# Altium schematic sheet PowerBoard.SchDoc
size A3; SheetNumber: 1; SheetTotal: 1
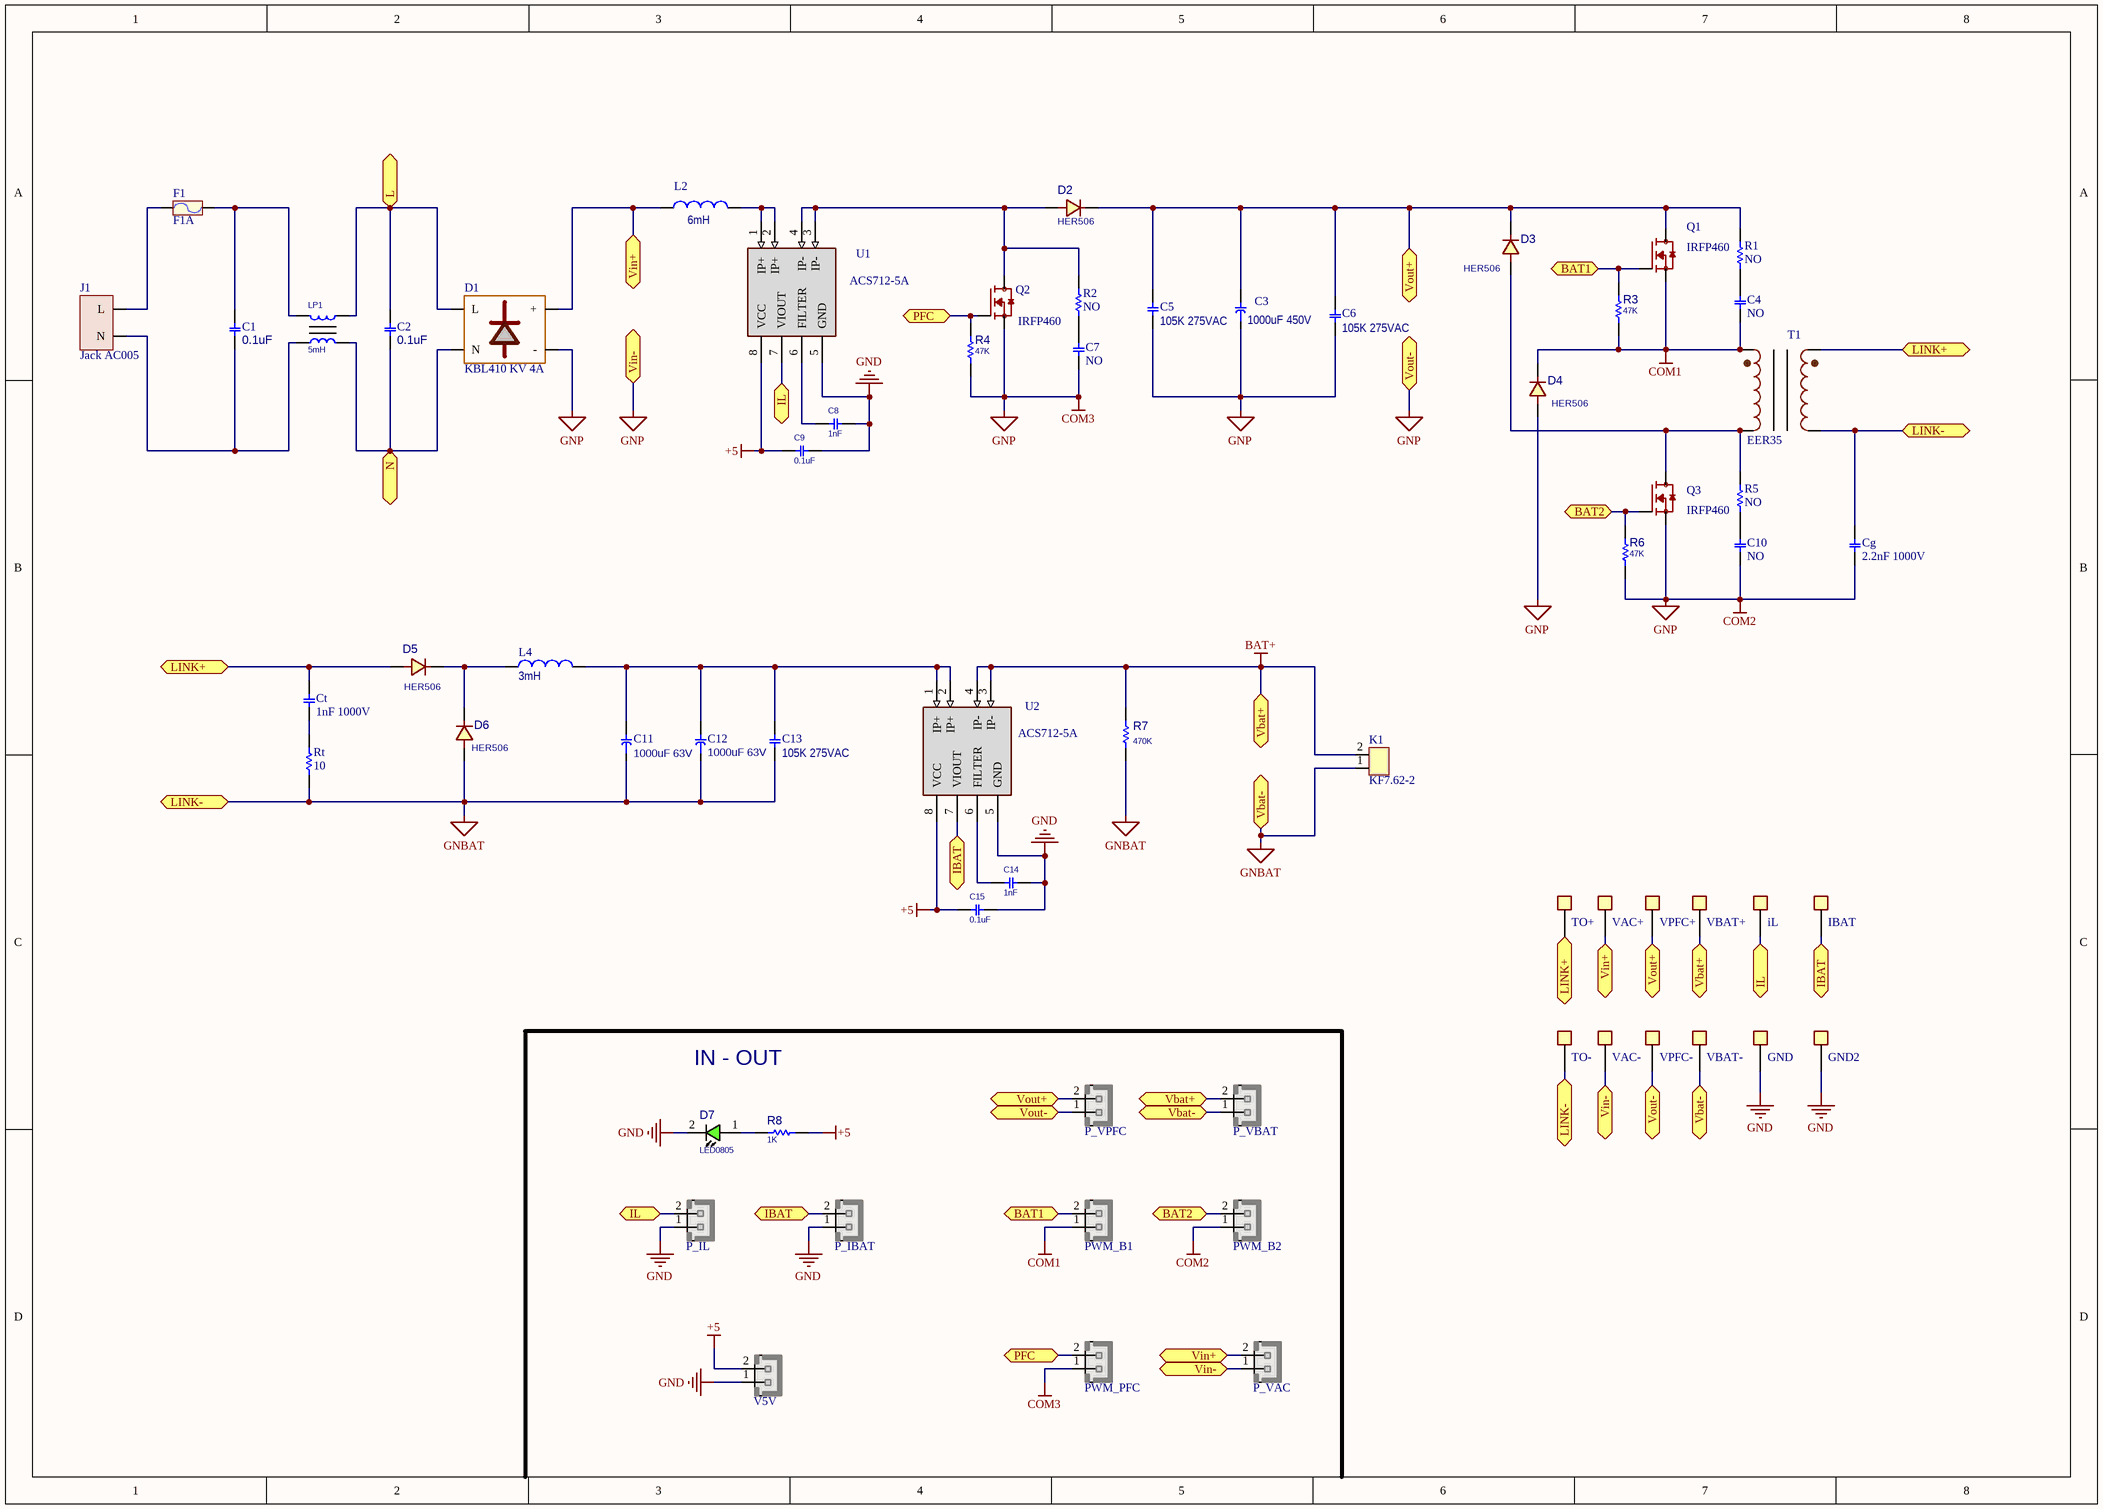
[diagram p0: PowerBoard.SchDoc]

## Parts
C1  0.1uF  [CAP P=15MM]
C2  0.1uF  [CAP P=15MM]
C3  1000uF 450V  [cap dxl 35x45]
C4  NO  [CAP CBB22 100nF/630V]
C5  105K 275VAC  [CAP P=22.5mm Len=26.5]
C6  105K 275VAC  [CAP P=22.5mm Len=26.5]
C7  NO  [CAP CBB22 100nF/630V]
C8  1nF  [cap_0805]
C9  0.1uF  [cap_0805]
C10  NO  [CAP CBB22 100nF/630V]
C11  1000uF 63V  [CAP DxL 16x25]
C12  1000uF 63V  [CAP DxL 16x25]
C13  105K 275VAC  [CAP P=22.5mm Len=26.5]
C14  1nF  [cap_0805]
C15  0.1uF  [cap_0805]
Cg  2.2nF 1000V  [CAP CERAMIC Blue]
Ct  1nF 1000V  [CAP CERAMIC Blue]
D1  KBL410 KV 4A  [SIP-4 KBL]
D2  value HER506  [DIODE DO-201AD]  (hidden comment: DIODE DIP)
D3  value HER506  [DIODE DO-201AD]  (hidden comment: DIODE DIP)
D4  value HER506  [DIODE DO-201AD]  (hidden comment: DIODE DIP)
D5  value HER506  [DIODE DO-201AD]  (hidden comment: DIODE DIP)
D6  value HER506  [DIODE DO-201AD]  (hidden comment: DIODE DIP)
D7  LED0805  [LED0805]
F1  F1A  [FUSE]
GND  test PCB  [Tp_black_1p]  (value not drawn)
GND2  test PCB  [Tp_black_1p]  (value not drawn)
IBAT  test PCB  [tp_red_1p]  (value not drawn)
iL  test PCB  [tp_red_1p]  (value not drawn)
J1  Jack AC005  [AC005]
K1  KF7.62-2  [KF_2PIN]
L2  6mH  [IND 40P]
L4  3mH  [IND 40P]
LP1  5mH  [Filter Inductor]
P_IBAT  HHDR_2  [XH_2]  (value not drawn)
P_IL  HHDR_2  [XH_2]  (value not drawn)
P_VAC  HHDR_2  [VH-2]  (value not drawn)
P_VBAT  HHDR_2  [VH-2]  (value not drawn)
P_VPFC  HHDR_2  [VH-2]  (value not drawn)
PWM_B1  HHDR_2  [VH-2]  (value not drawn)
PWM_B2  HHDR_2  [VH-2]  (value not drawn)
PWM_PFC  HHDR_2  [VH-2]  (value not drawn)
Q1  IRFP460  [TO-247 - HS342512]
Q2  IRFP460  [TO-247 - HS342512]
Q3  IRFP460  [TO-247 - HS342512]
R1  NO  [R-2W]
R2  NO  [R-2W]
R3  47K  [R0805]
R4  47K  [R0805]
R5  NO  [R-2W]
R6  47K  [R0805]
R7  470K  [R1206]
R8  1K  [R0805]
Rt  10  [R1/4W4]
T1  EER35  [Pulse Transformer]
TO+  test PCB  [tp_red_1p]  (value not drawn)
TO-  test PCB  [Tp_black_1p]  (value not drawn)
U1  ACS712-5A  [ACS712]
U2  ACS712-5A  [ACS712]
V5V  HHDR_2  [VH-2]  (value not drawn)
VAC+  test PCB  [tp_red_1p]  (value not drawn)
VAC-  test PCB  [Tp_black_1p]  (value not drawn)
VBAT+  test PCB  [tp_red_1p]  (value not drawn)
VBAT-  test PCB  [Tp_black_1p]  (value not drawn)
VPFC+  test PCB  [tp_red_1p]  (value not drawn)
VPFC-  test PCB  [Tp_black_1p]  (value not drawn)

## Ports
BAT1 (bidir), BAT2 (bidir), IBAT (bidir), IL (bidir), L (bidir), LINK+ (bidir), LINK- (bidir), N (bidir), PFC (bidir), Vbat+ (bidir), Vbat- (bidir), Vin+ (bidir), Vin- (bidir), Vout+ (bidir), Vout- (bidir)

## Nets
+5: C9.2 C15.2 R8.2 U1.8(VCC) U2.8(VCC) V5V.2
BAT+: K1.2 P_VBAT.2 R7.2 U2.3(IP-) U2.4(IP-) VBAT+.1 ; port Vbat+
COM1: C4.1 D4.2 PWM_B1.1 Q1.3(S) R3.2 T1.2
COM2: C3.2 C5.1 C6.1 C7.1 C10.1 Cg.1 D1.4(-) D4.1 P_VAC.1 P_VPFC.1 PWM_B2.1 PWM_PFC.1 Q2.3(S) Q3.3(S) R4.1 R6.2 VAC-.1 VPFC-.1 ; port Vin-, port Vout-  [also labelled COM3, GNP]
GNBAT: C11.2 C12.2 C13.1 Cg.2 D6.1 K1.1 P_VBAT.1 R7.1 Rt.1 T1.13 TO-.1 VBAT-.1 ; port LINK-, port Vbat-
GND: C8.2 C9.1 C14.2 C15.1 D7.2(CATHODE) GND.1 GND2.1 P_IBAT.1 P_IL.1 U1.5(GND) U2.5(GND) V5V.1
BAT1: PWM_B1.2 Q1.1(G) R3.1 ; port BAT1
BAT2: PWM_B2.2 Q3.1(G) R6.1 ; port BAT2
IBAT: IBAT.1 P_IBAT.2 U2.7(VIOUT) ; port IBAT
IL: iL.1 P_IL.2 U1.7(VIOUT) ; port IL
L: C2.2 D1.2(L) LP1.2 ; port L
LINK+: Ct.2 D5.1 T1.9 TO+.1 ; port LINK+
N: C2.1 D1.3(N) LP1.4 ; port N
PFC: PWM_PFC.2 Q2.1(G) R4.2 ; port PFC
Vin+: D1.1(+) L2.1 P_VAC.2 VAC+.1 ; port Vin+
Vout+: C3.1 C5.2 C6.2 D2.2 D3.2 P_VPFC.2 Q1.2(D) R1.2 VPFC+.1 ; port Vout+
NetC1_1: C1.1 J1.2(N) LP1.3
NetC1_2: C1.2 F1.2 LP1.1
NetC4_2: C4.2 R1.1
NetC7_2: C7.2 R2.1
NetC8_1: C8.1 U1.6(FILTER)
NetC10_2: C10.2 R5.1
NetC11_1: C11.1 C12.1 C13.2 L4.2 U2.1(IP+) U2.2(IP+)
NetC14_1: C14.1 U2.6(FILTER)
NetCt_1: Ct.1 Rt.2
NetD2_1: D2.1 Q2.2(D) R2.2 U1.3(IP-) U1.4(IP-)
NetD3_1: D3.1 Q3.2(D) R5.2 T1.3
NetD5_2: D5.2 D6.2 L4.1
NetD7_1: D7.1(ANODE) R8.1
NetF1_1: F1.1 J1.1(L)
NetL2_2: L2.2 U1.1(IP+) U1.2(IP+)

## Notes on the sheet
- IN - OUT

## Library data of the parts
C1 C2 = CAP Keo: 100nF 104J 275VAC; Value: 0,047uF; Copyright: VanDungEvn
C3 C11 C12 = CAP DIP
C4-C7 C10 C13 = CAP Keo: Value: 0,047uF; Copyright: VanDungEvn
C8 C9 C14 C15 = CAP SMD: PARAM: -, -%; MANF_P#: MANF_PART#; PARAM2: -V; PRICE: 100= 1$; MANF: -; ASSEMBLY: ASSEMBLY
  C8 C14: VALUE: 1nF
  C9 C15: VALUE: 0.1uF
Cg = CAP Keo: Tu Gom Xanh 2.2nF 1000V; Value: 0,047uF; Copyright: VanDungEvn
Ct = CAP Keo: Tu Gom Xanh 1nF 1000V; Value: 0,047uF; Copyright: VanDungEvn
D1 = Diode Bridge: Diode Bridge 1KV 4A
D2-D6 = DIODE DIP: MANF: Kingtronics; DESC: DESCRIPTION; PARAM: 1000V VRRM; PARAM2: 1A; MANF_P#: M7; ASSEMBLY: ASSEMBLY; PRICE: PRICE
D7 = LED_SMD_0805: LED, SMD, 0805; DESC: DESCRIPTION; MANF_P#: MANF_PART#; PARAM2: 2.2V; MANF: MANF; ASSEMBLY: ASSEMBLY; PRICE: PRICE; VALUE: LED0805
F1 = Fuse: Cau Chi ong Thuy Tinh 3A 5x20mm; Value: Fuse; Designed by: VanDungEvn
GND GND2 IBAT iL TO+ TO- VAC+ VAC- VBAT+ VBAT- VPFC+ VPFC- = test PCB: testpin
J1 = Jack AC: AC005 5A
K1 = KF_2PIN
L2 L4 = IND DIP: Manufacturer: Murata; Manufacturer Part Number: LQW15AN2N2G80D; LCSC: C412264
LP1 = IND Filter 15mH: 5mH UU9.8-502; PARAM: 25~35A (Irms), 68A Isat, -40~165oC; MANF: Coilcraft; PARAM2: 1.7mOhm, 3mm Height; MANF_P#: XAL1030-301MEC; VALUE: 300nH; PRICE: 4$; ASSEMBLY: ASSEMBLY
P_IBAT P_IL = XH_2: XH 2 JST-XH pitch: 2.5mm; VALUE: HHDR_2
P_VAC P_VBAT P_VPFC PWM_B1 PWM_B2 PWM_PFC V5V = VH-2: VALUE: HHDR_2
Q1-Q3 = MOSFET IRFP460: MOSFET N-Channel 500 V 20A (Tc) 280W (Tc) Through Hole TO-247AC; MF: Vishay Siliconix; SnapEDA_Link: https://www.snapeda.com/parts/IRFP460/Vishay+Siliconix/view-part/?ref=snap; Package: TO-247 Vishay Siliconix; MP: IRFP460; Check_prices: https://www.snapeda.com/parts/IRFP460/Vishay+Siliconix/view-part/?ref=eda; Purchase-URL: https://pricing.snapeda.com/search/part/IRFP460/?ref=eda; Price: None; Value: *; Availability: In Stock
R1 R2 R5 = RES DIP: Value: R1/4W - 1K
R3 R4 R6-R8 = RES SMD: MANF_P#: WSLP0805R0100FEA; MANF: VISHAY; PARAM: 0.5W, -55~155oC; DESC: DESCRIPTION; DIST#: MOUSER; PARAM2: 1%; ASSEMBLY: ASSEMBLY; PRICE: 0.5$
  R3 R4 R6: VALUE: 47K
  R8: VALUE: 1K
Rt = RES DIP: 10 ohm, 1W; Value: R1/4W - 1K
T1 = Pulse Transformer
U1 U2 = ACS712ELCTR-T: MF: {'manufacturer': u'Allegro'}; MP: ACS712ELCTR-20A-T; Value: *; Availability: Unavailable; Package: None; Price: None